# Altium project LSS_Bottom_Board_v3.4.PrjPcb (part 3 of 3)

## Sheet Temp_Probe_Section.SchDoc
size A4; DocumentNumber: 9; SheetNumber: 8; SheetTotal: 10
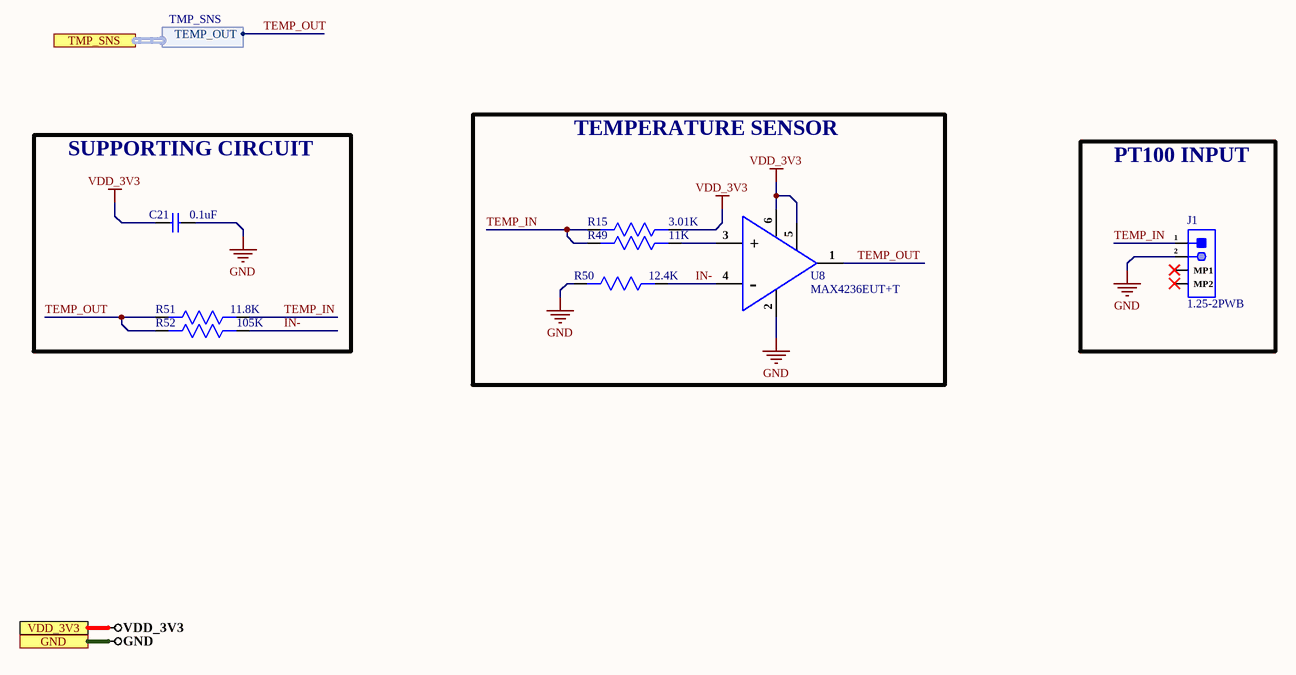
[diagram p8: Temp_Probe_Section.SchDoc]

### Parts
C21  0.1uF  [Cap 0603]
J1  1.25-2PWB  [1.25-2PWB]
R15  3.01K  [Res0603]
R49  11K  [Res0603]
R50  12.4K  [Res0603]
R51  11.8K  [Res0603]
R52  105K  [Res0603]
U8  MAX4236EUT+T  [SOT-23-6]

### Blocks framed on the sheet
SUPPORTING CIRCUIT: C21 R51 R52
TEMPERATURE SENSOR: R15 R49 R50 U8
PT100 INPUT: J1

### Ports
GND, TMP_SNS (harness TMP_SNS), VDD_3V3

### Harnesses
TMP_SNS: TEMP_OUT

### Nets
GND: C21.2 J1.2 R50.2 U8.2(VEE) ; port GND
VDD_3V3: C21.1 R15.1 U8.5(~{SHDN}) U8.6(VCC) ; port VDD_3V3
IN-: R50.1 R52.1 U8.4(-)
TEMP_IN: J1.1 R15.2 R49.2 R51.1
TEMP_OUT: R51.2 R52.2 U8.1(OUT) ; port TMP_SNS.TEMP_OUT
NetR49_1: R49.1 U8.3(+)

Not connected (* = marked no-connect by the designer): J1 MP1* MP2*

### Library data of the parts
C21 = CL10B104KB8NNNC: Cap Ceramic 0.1uF 50VDC X7R 10% SMD 0603 Paper T/R; Manufacturer: Samsung; Capacitance: 100nF; Voltage Rating: 50V; Supplier 1: Digi-Key; Manufacturer Part Number: CL10B104KB8NNNC; RoHS: Yes; Category: Ceramic Capacitors; Stock 1: 3998791; Pricing 1: 1=0.10000, 10=0.03000, 50=0.01640, 100=0.01340, 500=0.00954, 1000=0.00750 (USD); Mount: Surface Mount; Case/Package: 0603; Case Code (Metric): 1608; Case Code (Imperial): 0603; Material: Ceramic; Contact Plating: Tin; Min Operating Temperature: -55°C; Max Operating Temperature: 125°C; Dielectric: X7R; Tolerance: 10%; Package Quantity: 1; Packaging: Tape and Reel; Voltage: 50V; Voltage Rating (DC): 50V; Series: CL; Construction: Flat; Length: 1.6mm; Width: 0.031inch; Height: 0.8mm; Depth: 0.8mm; Thickness: 0.035inch; Radiation Hardening: No; Lead Free: Lead Free; RoHS Compliant: Yes; ComponentLink1URL: https://datasheet.ciiva.com/25803/cl10b104kb8nnnc-25803393.pdf?src-supplier=Digi-Key; ComponentLink1Description: https://datasheet.ciiva.com/25803/cl10b104kb8nnnc-25803393.pdf?src-supplier=Digi-Key; ComponentLink2URL: https://datasheet.ciiva.com/26838/getdatasheetpartid-89097-26838411.pdf?src-supplier=Verical; ComponentLink2Description: https://datasheet.ciiva.com/26838/getdatasheetpartid-89097-26838411.pdf?src-supplier=Verical; ComponentLink3URL: https://datasheet.ciiva.com/29198/456651-da-01-en-vs-kondensator-0605-29198839.pdf?src-supplier=Conrad; ComponentLink3Description: https://datasheet.ciiva.com/29198/456651-da-01-en-vs-kondensator-0605-29198839.pdf?src-supplier=Conrad; Supplier Part Number 1: 1276-1000-1-ND
J1 = 1.25-2PWB: 1x2P 2P 1 1.25mm 2 -40℃~+85℃ Surface Mount SMD,P=1.25mm,Surface Mount，Right Angle Wire To Board / Wire To Wire Connector ROHS; Manufacturer: DEALON; Item Type: Wire To Board Connector; Manufacturer Part Number: 1.25-2PWB; Package: SMD,P=1.25mm Right Angle; LCSC Part Number: C2905009; ComponentLink1Description: LCSC; ComponentLink1URL: https://www.lcsc.com/product-detail/Wire-To-Board-Wire-To-Wire-Connector_DEALON-1-25-2PWB_C2905009.html
R15 = ERJ3EKF3011V: RES SMD 3.01K OHM 1% 1/10W 0603; Manufacturer: Panasonic; Manufacturer Part Number: ERJ-3EKF3011V; Resistance: 3.01kR; Power Rating: 100mW; Voltage Rating: 75V; Temperature Coefficient: 100ppm/°C; Voltage Rating (DC): 50V; Supplier 1: Digi-Key; RoHS: Yes; Category: Chip SMD Resistors; Stock 1: 64217; Pricing 1: 1=0.10000, 10=0.03900, 100=0.01590, 1000=0.00713, 2500=0.00619 (USD); Mount: Surface Mount; Case/Package: 0603; Case Code (Metric): 1608; Case Code (Imperial): 0603; Contact Plating: Tin; Min Operating Temperature: -55°C; Max Operating Temperature: 155°C; Tolerance: 1%; Packaging: Tape and Reel; Package Quantity: 1; Resistor Type: Thick Film; Number of Terminations: 2; Termination: SMD/SMT; Max Power Dissipation: 100mW; Working Voltage: 75V; Features: Automotive AEC-Q200; Series: ERJ; Resistance Tolerance: 1%; Construction: Rectangular; Technology: THICK FILM; Length: 1.6mm; Width: 0.031inch; Height: 0.022inch; Depth: 0.8mm; Radiation Hardening: No; REACH SVHC: No SVHC; Military Standard: Not; Lead Free: Lead Free; RoHS Compliant: Yes; ComponentLink1URL: https://datasheet.ciiva.com/48530/aoa0000ce2-48530997.pdf?src-supplier=Avnet; ComponentLink1Description: https://datasheet.ciiva.com/48530/aoa0000ce2-48530997.pdf?src-supplier=Avnet; ComponentLink2URL: https://datasheet.ciiva.com/9117/aoa0000ce2-9117094.pdf?src-supplier=Avnet; ComponentLink2Description: https://datasheet.ciiva.com/9117/aoa0000ce2-9117094.pdf?src-supplier=Avnet; ComponentLink3URL: https://datasheet.ciiva.com/24069/aoa0000ce2-24069032.pdf?src-supplier=Mouser; ComponentLink3Description: https://datasheet.ciiva.com/24069/aoa0000ce2-24069032.pdf?src-supplier=Mouser; ComponentLink4URL: https://datasheet.ciiva.com/46377/426256-46377976.pdf?src-supplier=Element14; ComponentLink4Description: https://datasheet.ciiva.com/46377/426256-46377976.pdf?src-supplier=Element14; ComponentLink5URL: https://datasheet.ciiva.com/16762/70260748-16762377.pdf?src-supplier=Allied+Electronics; ComponentLink5Description: https://datasheet.ciiva.com/16762/70260748-16762377.pdf?src-supplier=Allied+Electronics; ComponentLink6URL: https://datasheet.ciiva.com/16511/aoa0000ce2-16511707.pdf?src-supplier=Avnet+Asia; ComponentLink6Description: https://datasheet.ciiva.com/16511/aoa0000ce2-16511707.pdf?src-supplier=Avnet+Asia; ComponentLink7URL: https://datasheet.ciiva.com/28695/1678782-28695803.pdf?src-supplier=Element14; ComponentLink7Description: https://datasheet.ciiva.com/28695/1678782-28695803.pdf?src-supplier=Element14; ComponentLink8URL: https://datasheet.ciiva.com/16773/70260748-16773212.pdf?src-supplier=Allied+Electronics; ComponentLink8Description: https://datasheet.ciiva.com/16773/70260748-16773212.pdf?src-supplier=Allied+Electronics; ComponentLink9URL: https://datasheet.ciiva.com/5969/426256-5969261.pdf?src-supplier=Farnell; ComponentLink9Description: https://datasheet.ciiva.com/5969/426256-5969261.pdf?src-supplier=Farnell; Supplier Part Number 1: P3.01KHCT-ND
R49 = RC0603FR-0711KL: RES SMD 11K, 1%, 0.1W, 0603; Manufacturer: Yageo; Power Rating: 100mW; Temperature Coefficient: 100ppm/°C; Resistance: 11kR; Voltage Rating: 50V; Working Voltage: 75V; Supplier 1: Digi-Key; Manufacturer Part Number: RC0603FR-0711KL; RoHS: Yes; Category: Chip SMD Resistors; Stock 1: 380174; Pricing 1: 1=0.10000, 10=0.02400, 100=0.00970, 1000=0.00436, 2500=0.00378 (USD); Case/Package: 0603; Number of Pins: 2; Case Code (Imperial): 0603; Case Code (Metric): 1608; Min Operating Temperature: -55°C; Max Operating Temperature: 155°C; Tolerance: 1%; Series: RC; Technology: THICK FILM; Packaging: Tape and Reel; Package Quantity: 1; Termination: SMD/SMT; Resistor Type: Thick Film; Number of Terminations: 2; Max Power Dissipation: 100mW; Voltage Rating (DC): 50V; Features: Moisture Resistant; Resistance Tolerance: 1%; Construction: Rectangular; Length: 1.6mm; Width: 0.031inch; Height: 0.022inch; Depth: 0.8mm; RoHS Compliant: Yes; REACH SVHC: No SVHC; Military Standard: Not; Lead Free: Lead Free; ComponentLink1URL: https://datasheet.ciiva.com/2454/pyu-r-int-thick-7-2454516.pdf?src-supplier=Digi-Key; ComponentLink1Description: https://datasheet.ciiva.com/2454/pyu-r-int-thick-7-2454516.pdf?src-supplier=Digi-Key; ComponentLink2URL: https://datasheet.ciiva.com/2454/pyu-r-int-thick-7-2454517.pdf?src-supplier=Digi-Key; ComponentLink2Description: https://datasheet.ciiva.com/2454/pyu-r-int-thick-7-2454517.pdf?src-supplier=Digi-Key; ComponentLink3URL: https://datasheet.ciiva.com/2454/pyu-r-int-thick-7-2454518.pdf?src-supplier=Digi-Key; ComponentLink3Description: https://datasheet.ciiva.com/2454/pyu-r-int-thick-7-2454518.pdf?src-supplier=Digi-Key; ComponentLink4URL: https://datasheet.ciiva.com/46395/443971-46395020.pdf?src-supplier=Element14; ComponentLink4Description: https://datasheet.ciiva.com/46395/443971-46395020.pdf?src-supplier=Element14; ComponentLink5URL: https://datasheet.ciiva.com/15189/getdatasheetpartid-251835-15189597.pdf?src-supplier=Verical; ComponentLink5Description: https://datasheet.ciiva.com/15189/getdatasheetpartid-251835-15189597.pdf?src-supplier=Verical; Supplier Part Number 1: 311-11.0KHRCT-ND
R50 = RC0603FR-0712K4L: RES SMD 12.4K OHM 1% 1/10W 0603; Manufacturer: Yageo; Resistance: 12.4kR; Power Rating: 100mW; Voltage Rating: 50V; Temperature Coefficient: 100ppm/°C; Working Voltage: 75V; Supplier 1: Digi-Key; Manufacturer Part Number: RC0603FR-0712K4L; RoHS: Yes; Category: Chip SMD Resistors; Stock 1: 494008; Pricing 1: 1=0.10000, 10=0.02400, 100=0.00970, 1000=0.00436, 2500=0.00378 (USD); Case/Package: 0603; Case Code (Metric): 1608; Case Code (Imperial): 0603; Min Operating Temperature: -55°C; Max Operating Temperature: 155°C; Packaging: Tape and Reel; Tolerance: 1%; Package Quantity: 1; Resistor Type: Thick Film; Number of Terminations: 2; Termination: SMD/SMT; Max Power Dissipation: 100mW; Voltage Rating (DC): 50V; Features: Moisture Resistant; Series: RC; Construction: Rectangular; Technology: THICK FILM; Length: 0.063inch; Width: 0.031inch; Height: 0.022inch; Depth: 0.8mm; Military Standard: Not; Lead Free: Lead Free; RoHS Compliant: Yes; ComponentLink1URL: https://datasheet.ciiva.com/2454/pyu-r-int-thick-7-2454069.pdf?src-supplier=Digi-Key; ComponentLink1Description: https://datasheet.ciiva.com/2454/pyu-r-int-thick-7-2454069.pdf?src-supplier=Digi-Key; ComponentLink2URL: https://datasheet.ciiva.com/2454/pyu-r-int-thick-7-2454070.pdf?src-supplier=Digi-Key; ComponentLink2Description: https://datasheet.ciiva.com/2454/pyu-r-int-thick-7-2454070.pdf?src-supplier=Digi-Key; ComponentLink3URL: https://datasheet.ciiva.com/2454/pyu-r-int-thick-7-2454071.pdf?src-supplier=Digi-Key; ComponentLink3Description: https://datasheet.ciiva.com/2454/pyu-r-int-thick-7-2454071.pdf?src-supplier=Digi-Key; Supplier Part Number 1: 311-12.4KHRCT-ND
R51 = AC0603FR-0711K8L: RES SMD 11.8K OHM 1% 1/10W 0603; Manufacturer: Yageo; Resistance: 11.8kR; Max Power Dissipation: 100mW; Temperature Coefficient: 100ppm/°C; Supplier 1: Avnet; Manufacturer Part Number: AC0603FR-0711K8L; RoHS: Yes; Category: Chip SMD Resistors; Pricing 1: 5000=0.00176, 10000=0.00174, 20000=0.00169, 30000=0.00165, 40000=0.00159, 50000=0.00155, 500000=0.00151 (USD); Case/Package: 0603; Min Operating Temperature: -55°C; Max Operating Temperature: 155°C; Packaging: Tape and Reel; Resistor Type: Thick Film; Number of Terminations: 2; Tolerance: 1%; Features: Moisture Resistant,Automotive AEC-Q200; Length: 0.063inch; Width: 0.031inch; Height: 0.022inch; RoHS Compliant: Yes; ComponentLink1URL: http://www.yageo.com/NewPortal/yageodocoutput?fileName=/pdf/R-Chip/PYu-AC_51_RoHS_L_6.pdf&src-supplier=Digi-Key; ComponentLink1Description: http://www.yageo.com/NewPortal/yageodocoutput?fileName=/pdf/R-Chip/PYu-AC_51_RoHS_L_6.pdf&src-supplier=Digi-Key; Supplier Part Number 1: AC0603FR-0711K8L
R52 = RC0603FR-07105KL: RES SMD 105K OHM 1% 1/10W 0603; Manufacturer: Yageo; Resistance: 105kR; Power Rating: 100mW; Voltage Rating: 75V; Temperature Coefficient: 100ppm/°C; Voltage Rating (DC): 50V; Supplier 1: Digi-Key; Manufacturer Part Number: RC0603FR-07105KL; RoHS: Yes; Category: Chip SMD Resistors; Stock 1: 76313; Pricing 1: 1=0.10000, 10=0.02400, 100=0.00970, 1000=0.00436, 2500=0.00378 (USD); Mount: Surface Mount; Case/Package: 0603; Case Code (Metric): 1608; Case Code (Imperial): 0603; Weight: 7.1E-05oz; Size Code: 0603; Min Operating Temperature: -55°C; Max Operating Temperature: 155°C; Tolerance: 1%; Packaging: Tape and Reel; Package Quantity: 1; Resistor Type: Thick Film; Number of Terminations: 2; Termination: SMD/SMT; Max Power Dissipation: 100mW; Features: Moisture Resistant; Series: RC; Construction: Rectangular; Technology: THICK FILM; Length: 1.6mm; Width: 0.031inch; Height: 0.45mm; Depth: 0.8mm; Military Standard: Not; Lead Free: Lead Free; RoHS Compliant: Yes; ComponentLink1URL: https://datasheet.ciiva.com/11819/0900766b80f96399-11819228.pdf?src-supplier=RSComponents; ComponentLink1Description: https://datasheet.ciiva.com/11819/0900766b80f96399-11819228.pdf?src-supplier=RSComponents; ComponentLink2URL: https://datasheet.ciiva.com/2455/pyu-r-int-thick-7-2455239.pdf?src-supplier=Digi-Key; ComponentLink2Description: https://datasheet.ciiva.com/2455/pyu-r-int-thick-7-2455239.pdf?src-supplier=Digi-Key; ComponentLink3URL: https://datasheet.ciiva.com/2455/pyu-r-int-thick-7-2455240.pdf?src-supplier=Digi-Key; ComponentLink3Description: https://datasheet.ciiva.com/2455/pyu-r-int-thick-7-2455240.pdf?src-supplier=Digi-Key; ComponentLink4URL: https://datasheet.ciiva.com/2455/pyu-r-int-thick-7-2455241.pdf?src-supplier=Digi-Key; ComponentLink4Description: https://datasheet.ciiva.com/2455/pyu-r-int-thick-7-2455241.pdf?src-supplier=Digi-Key; Supplier Part Number 1: 311-105KHRCT-ND
U8 = MAX4236EUT+T: IC OPAMP GP 1.7MHZ RRO SOT23-6; Manufacturer: Maxim; Common Mode Rejection Ratio: 102dB; Max Supply Voltage: 5.5V; Min Supply Voltage: 2.4V; Voltage Gain: 128dB; Max Power Dissipation: 696mW; Slew Rate: 0.3V/µs; Input Offset Voltage (Vos): 5uV; Input Bias Current: 1pA; Operating Supply Current: 350uA; Number of Channels: 1; Power Supply Rejection Ratio (PSRR): 120dB; Output Current per Channel: 30mA; Supply Type: Single; Dual Supply Voltage: 2.75V; Amplifier Type: GENERAL PURPOSE; Supplier 1: Digi-Key; Manufacturer Part Number: MAX4236EUT+T; RoHS: Yes; Category: Amplifiers - Op Amps, Buffer, Instrumentation; Stock 1: 5148; Pricing 1: 1=2.31000, 10=2.07800, 25=1.96000, 100=1.66990, 250=1.56800, 500=1.47000 (USD); Mount: Surface Mount; Case/Package: SOT-23-6; Number of Pins: 6; Contact Plating: Tin,Matte; Min Operating Temperature: -40°C; Max Operating Temperature: 85°C; Gain Bandwidth Product: 1.7MHz; Packaging: Tape and Reel; Package Quantity: 1; Number of Circuits: 1; Bandwidth: 1.7MHz; Nominal Supply Current: 350uA; Number of Amplifiers: 1; Supply Current: 350uA; Series: -; Length: 3mm; Width: 1.75mm; Height: 1.3mm; Radiation Hardening: No; REACH SVHC: Unknown; RoHS Compliant: Yes; ComponentLink1URL: https://datasheet.ciiva.com/26846/max4236eut-t-26846323.pdf?src-supplier=IIIC; ComponentLink1Description: https://datasheet.ciiva.com/26846/max4236eut-t-26846323.pdf?src-supplier=IIIC; ComponentLink2URL: https://datasheet.ciiva.com/1802/max4236-max4237-1802043.pdf?src-supplier=Digi-Key; ComponentLink2Description: https://datasheet.ciiva.com/1802/max4236-max4237-1802043.pdf?src-supplier=Digi-Key; ComponentLink3URL: https://datasheet.ciiva.com/14347/max4236-max4237-14347431.pdf?src-supplier=Avnet; ComponentLink3Description: https://datasheet.ciiva.com/14347/max4236-max4237-14347431.pdf?src-supplier=Avnet; ComponentLink4URL: https://datasheet.ciiva.com/1802/max4236-max4237-1802041.pdf?src-supplier=Digi-Key; ComponentLink4Description: https://datasheet.ciiva.com/1802/max4236-max4237-1802041.pdf?src-supplier=Digi-Key; ComponentLink5URL: https://datasheet.ciiva.com/1802/max4236-max4237-1802042.pdf?src-supplier=Digi-Key; ComponentLink5Description: https://datasheet.ciiva.com/1802/max4236-max4237-1802042.pdf?src-supplier=Digi-Key; ComponentLink6URL: https://datasheet.ciiva.com/17574/max4236-max4237-17574234.pdf?src-supplier=Avnet+Europe; ComponentLink6Description: https://datasheet.ciiva.com/17574/max4236-max4237-17574234.pdf?src-supplier=Avnet+Europe; Supplier Part Number 1: MAX4236EUT+TCT-ND

## Nets that join several sheets
GND: Encoder-Sheet (C20.2 U3.7), Motion-Sensor-Sheet (5 pins), CAN-Sheet (7 pins), Processing-Section (71 pins), Connector-Section (8 pins), Sensor-Section (5 pins), Temp_Probe_Section (C21.2 J1.2 R50.2 U8.2)
VCC_5V: CAN-Sheet (FB3.1), Connector-Section (J3.A1)
VDD_3V3: Encoder-Sheet (FB1.1), Motion-Sensor-Sheet (FB2.1), CAN-Sheet (C22.1 R4.2 U5.5), Processing-Section (25 pins), Connector-Section (J3.B1 P1.1), Sensor-Section (FB4.1), Temp_Probe_Section (C21.1 R15.1 U8.5 U8.6)
BOOT0: Processing-Section (U1.94), Connector-Section (J3.A7)
BOOT1: Processing-Section (U1.37), Connector-Section (J3.A12)
BUTTON: Processing-Section (U1.63), Connector-Section (J3.A9)
CAN_IN.CAN_NH#: CAN-Sheet (R8.2 U2.7), Connector-Section (J3.A6)
CAN_IN.CAN_NL#: CAN-Sheet (R7.2 U2.6), Connector-Section (J3.A5)
CAN_NH_MCU: CAN-Sheet (Q2.1), Processing-Section (U1.17)
CAN_NL_MCU: CAN-Sheet (Q1.1), Processing-Section (U1.16)
CAN_OUT.CAN_RX: CAN-Sheet (U5.4), Processing-Section (U1.81)
CAN_OUT.CAN_TX: CAN-Sheet (R4.1 U2.1), Processing-Section (U1.82)
CAN_OUT.STB: CAN-Sheet (R5.1 U2.8), Processing-Section (U1.15)
DIAG0_SWN: Processing-Section (U1.78), Connector-Section (J3.B9)
DRV_DIR: Processing-Section (U1.65), Connector-Section (J3.B8)
DRV_ENN: Processing-Section (U1.79), Connector-Section (J3.B10)
DRV_STEP: Processing-Section (U1.64), Connector-Section (J3.B7)
EN_CS: Encoder-Sheet (Rx2.2), Processing-Section (U1.77)
EN_DATA: Encoder-Sheet (Rx3.2), Processing-Section (U1.90 U1.91)
EN_SCK: Encoder-Sheet (Rx1.2), Processing-Section (U1.89)
EVENT: Processing-Section (U1.33), Sensor-Section (U6.7)
I2C.INT1: Motion-Sensor-Sheet (U4.4), Processing-Section (U1.35)
I2C.INT2: Motion-Sensor-Sheet (U4.9), Processing-Section (U1.36)
I2C.SCL: Motion-Sensor-Sheet (RF2.1 U4.13), Processing-Section (U1.92)
I2C.SDA: Motion-Sensor-Sheet (RF3.1 U4.14), Processing-Section (U1.93)
LED_B: Processing-Section (U1.57), Connector-Section (J3.A8)
LED_G: Processing-Section (U1.60), Connector-Section (J3.B2)
LED_R: Processing-Section (U1.59), Connector-Section (J3.A2)
MISO: Processing-Section (U1.31), Connector-Section (J3.B6)
MOSI: Processing-Section (U1.32), Connector-Section (J3.B5)
NRST: Processing-Section (C15.1 SW1.1 SW1.2 U1.14), Connector-Section (P1.4)
SCLK_TEMP: Processing-Section (U1.47), Sensor-Section (R27.1 U6.6)
SDA_TEMP: Processing-Section (U1.48), Sensor-Section (R2.1 U6.5)
SPI_CS: Processing-Section (U1.29), Connector-Section (J3.B3)
SPI_SCK: Processing-Section (U1.30), Connector-Section (J3.B4)
SWCLK: Processing-Section (U1.76), Connector-Section (P1.3)
SWDIO: Processing-Section (U1.72), Connector-Section (P1.2)
TEMP_OUT: Processing-Section (U1.18), Temp_Probe_Section (R51.2 R52.2 U8.1)
TMC_1: Processing-Section (U1.53), Connector-Section (J3.A11)
TMC_2: Processing-Section (U1.54), Connector-Section (J3.A10)
USB_DM: Processing-Section (U1.70), Connector-Section (J3.A3)
USB_DP: Processing-Section (U1.71), Connector-Section (J3.A4)